# EAGLE design mux (EAGLE 9.6.2)
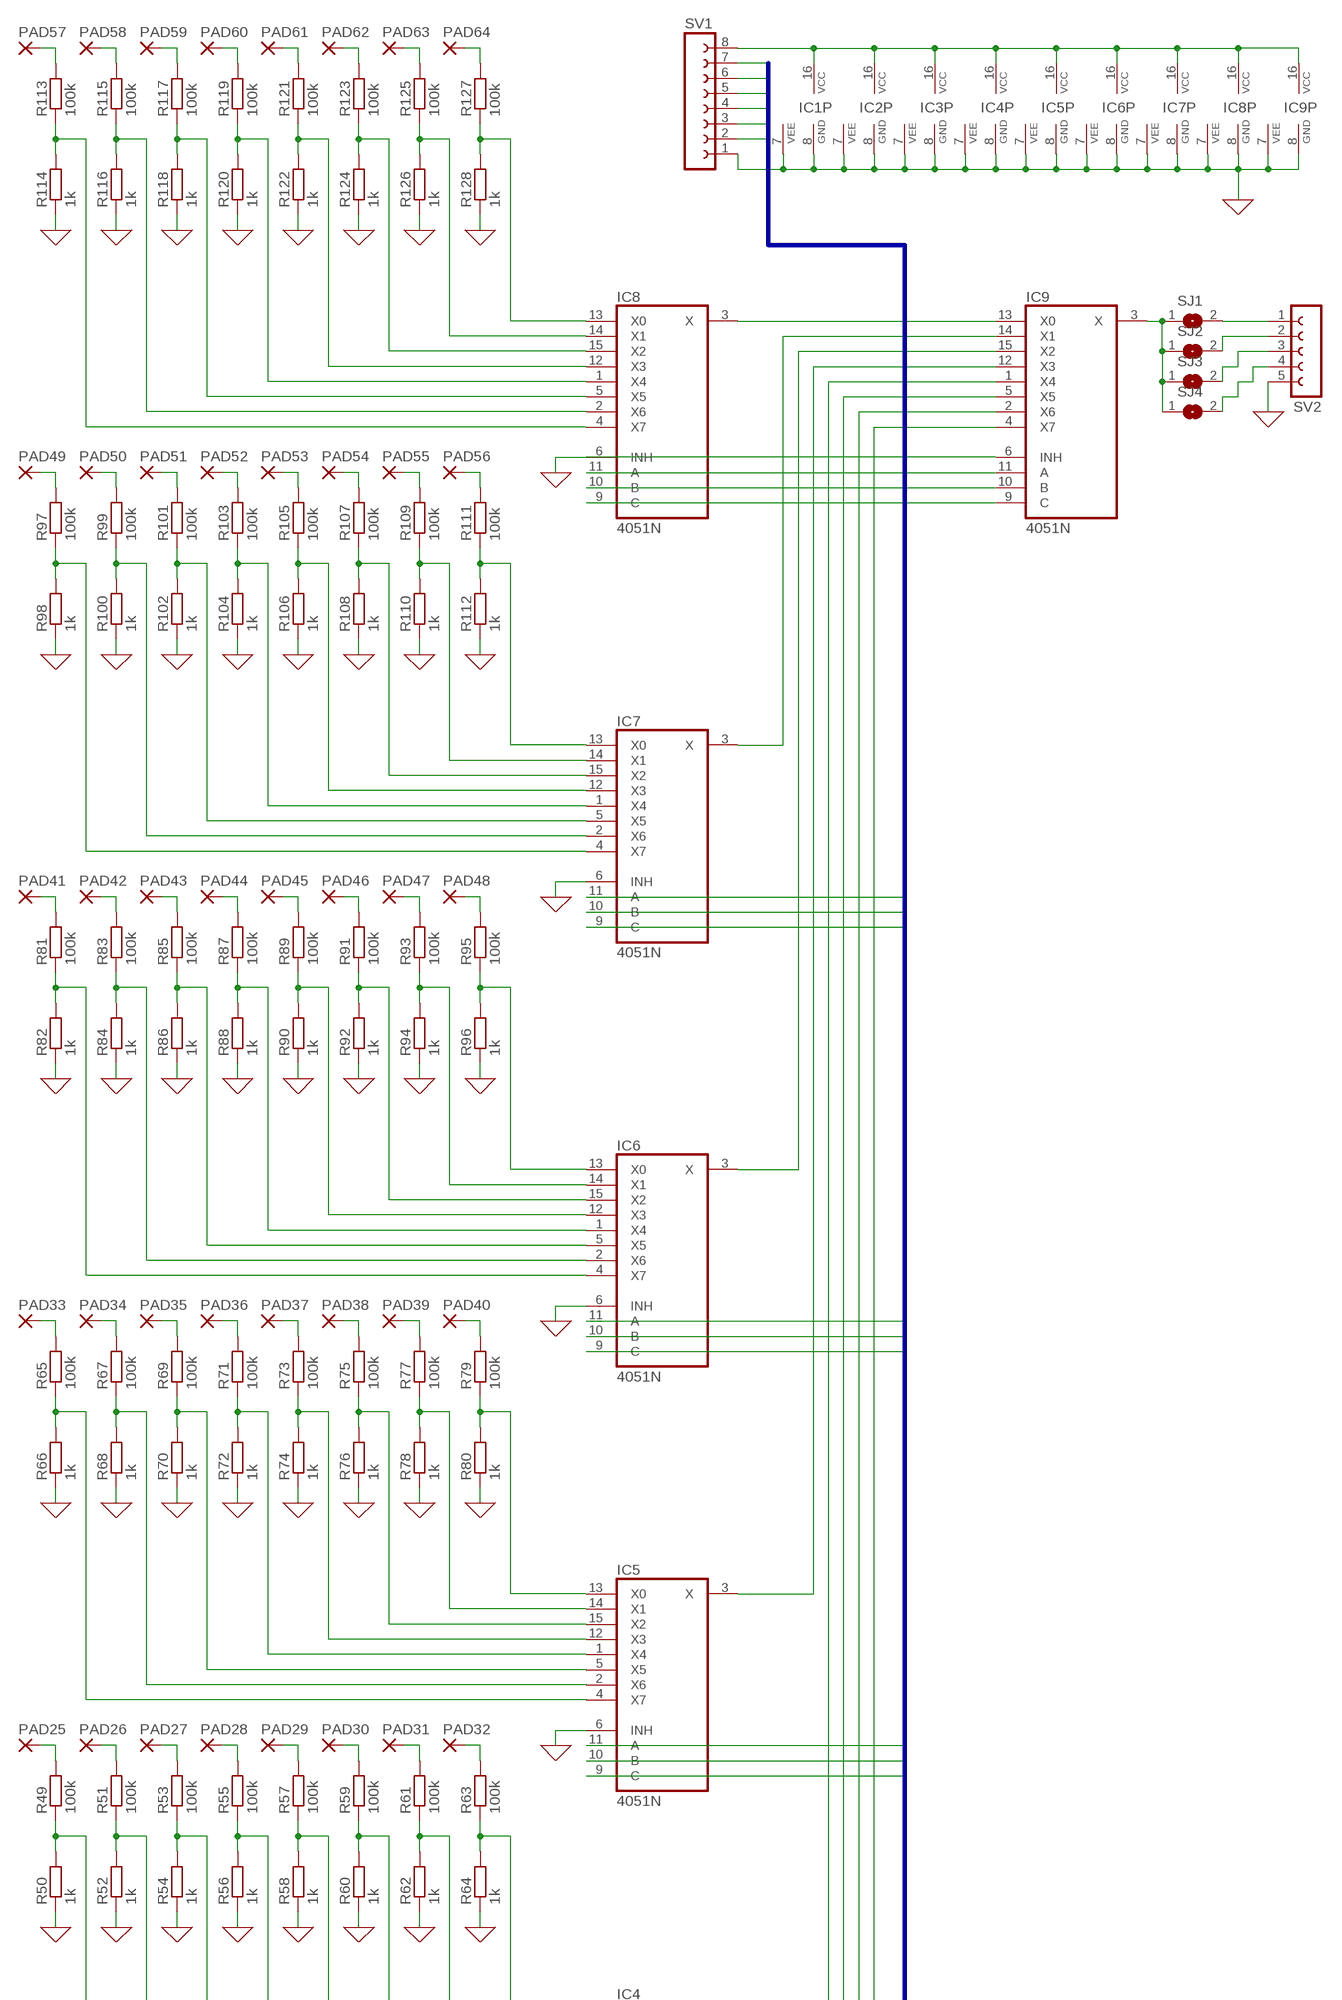
[diagram p0: schematic, sheet 1, part 1 of 2]
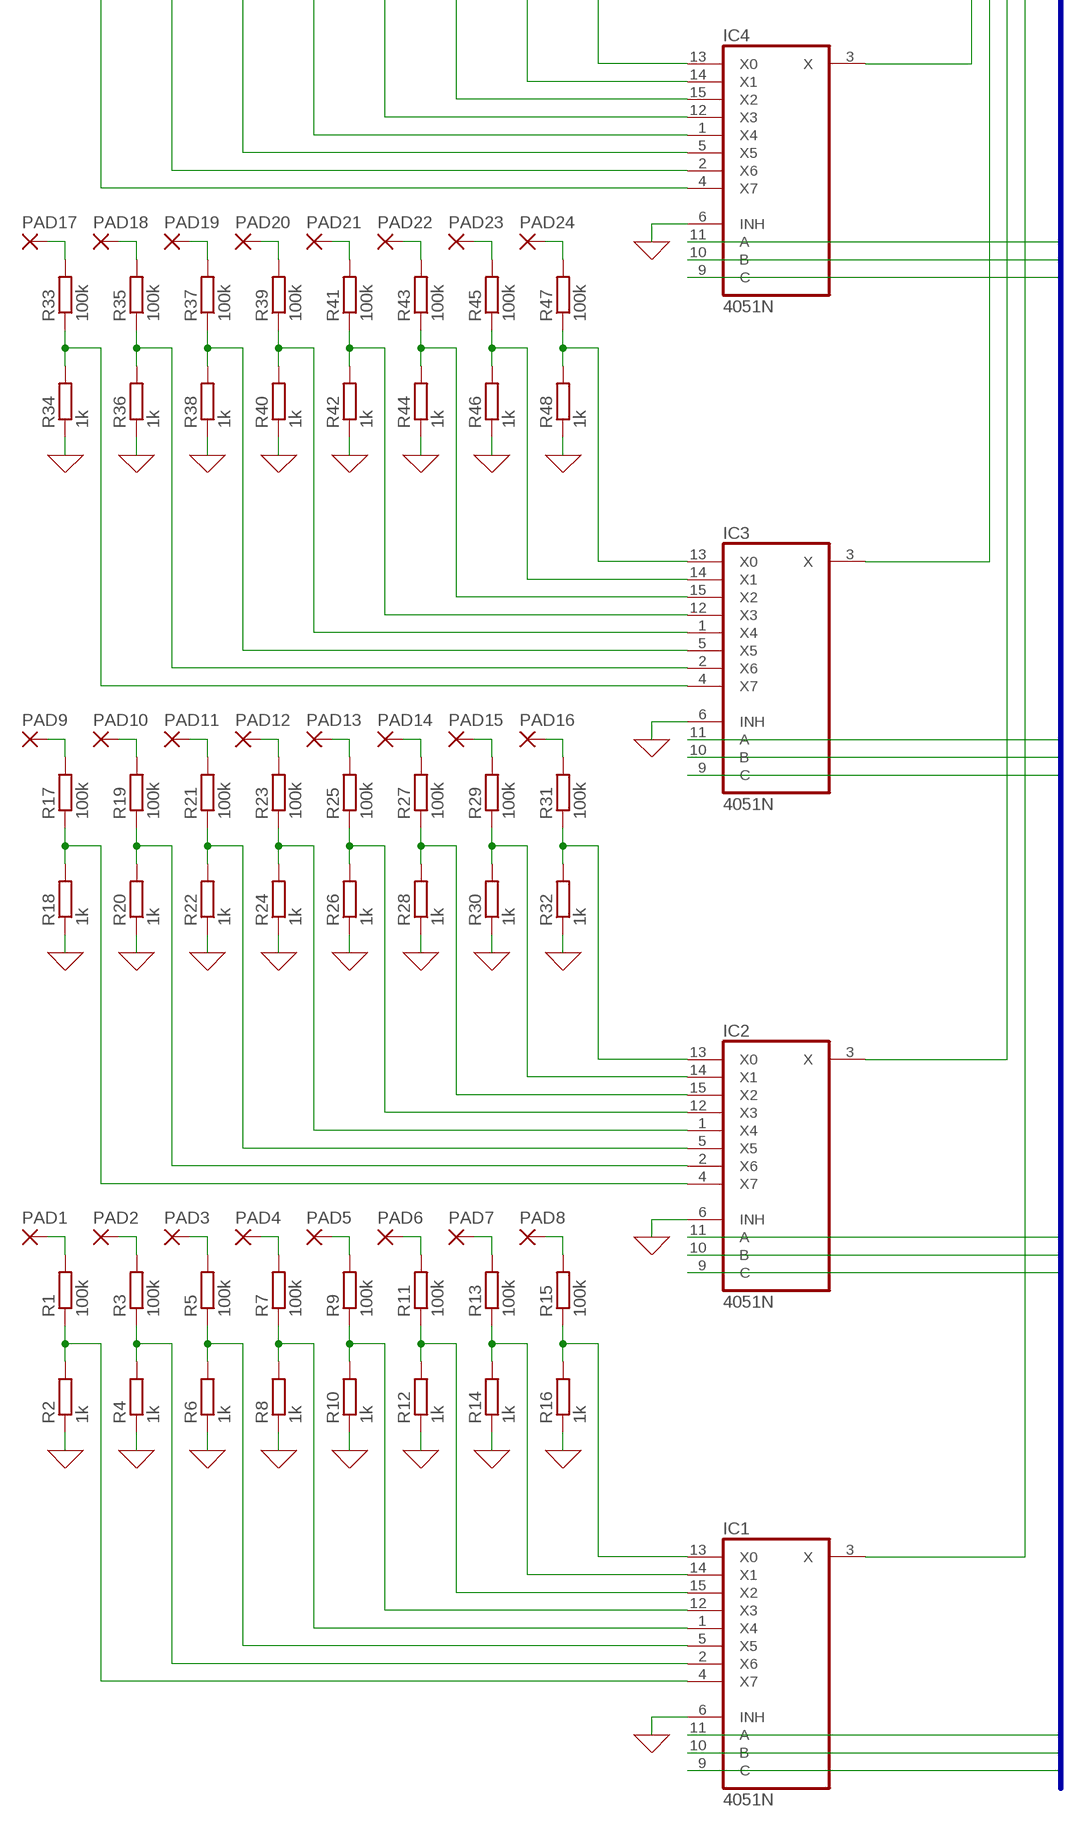
[diagram p1: schematic, sheet 1, part 2 of 2]

## Parts
IC1  4051N  [DIL16]
IC2  4051N  [DIL16]
IC3  4051N  [DIL16]
IC4  4051N  [DIL16]
IC5  4051N  [DIL16]
IC6  4051N  [DIL16]
IC7  4051N  [DIL16]
IC8  4051N  [DIL16]
IC9  4051N  [DIL16]
PAD1  1,6/0,9  [1,6/0,9]
PAD2  1,6/0,9  [1,6/0,9]
PAD3  1,6/0,9  [1,6/0,9]
PAD4  1,6/0,9  [1,6/0,9]
PAD5  1,6/0,9  [1,6/0,9]
PAD6  1,6/0,9  [1,6/0,9]
PAD7  1,6/0,9  [1,6/0,9]
PAD8  1,6/0,9  [1,6/0,9]
PAD9  1,6/0,9  [1,6/0,9]
PAD10  1,6/0,9  [1,6/0,9]
PAD11  1,6/0,9  [1,6/0,9]
PAD12  1,6/0,9  [1,6/0,9]
PAD13  1,6/0,9  [1,6/0,9]
PAD14  1,6/0,9  [1,6/0,9]
PAD15  1,6/0,9  [1,6/0,9]
PAD16  1,6/0,9  [1,6/0,9]
PAD17  1,6/0,9  [1,6/0,9]
PAD18  1,6/0,9  [1,6/0,9]
PAD19  1,6/0,9  [1,6/0,9]
PAD20  1,6/0,9  [1,6/0,9]
PAD21  1,6/0,9  [1,6/0,9]
PAD22  1,6/0,9  [1,6/0,9]
PAD23  1,6/0,9  [1,6/0,9]
PAD24  1,6/0,9  [1,6/0,9]
PAD25  1,6/0,9  [1,6/0,9]
PAD26  1,6/0,9  [1,6/0,9]
PAD27  1,6/0,9  [1,6/0,9]
PAD28  1,6/0,9  [1,6/0,9]
PAD29  1,6/0,9  [1,6/0,9]
PAD30  1,6/0,9  [1,6/0,9]
PAD31  1,6/0,9  [1,6/0,9]
PAD32  1,6/0,9  [1,6/0,9]
PAD33  1,6/0,9  [1,6/0,9]
PAD34  1,6/0,9  [1,6/0,9]
PAD35  1,6/0,9  [1,6/0,9]
PAD36  1,6/0,9  [1,6/0,9]
PAD37  1,6/0,9  [1,6/0,9]
PAD38  1,6/0,9  [1,6/0,9]
PAD39  1,6/0,9  [1,6/0,9]
PAD40  1,6/0,9  [1,6/0,9]
PAD41  1,6/0,9  [1,6/0,9]
PAD42  1,6/0,9  [1,6/0,9]
PAD43  1,6/0,9  [1,6/0,9]
PAD44  1,6/0,9  [1,6/0,9]
PAD45  1,6/0,9  [1,6/0,9]
PAD46  1,6/0,9  [1,6/0,9]
PAD47  1,6/0,9  [1,6/0,9]
PAD48  1,6/0,9  [1,6/0,9]
PAD49  1,6/0,9  [1,6/0,9]
PAD50  1,6/0,9  [1,6/0,9]
PAD51  1,6/0,9  [1,6/0,9]
PAD52  1,6/0,9  [1,6/0,9]
PAD53  1,6/0,9  [1,6/0,9]
PAD54  1,6/0,9  [1,6/0,9]
PAD55  1,6/0,9  [1,6/0,9]
PAD56  1,6/0,9  [1,6/0,9]
PAD57  1,6/0,9  [1,6/0,9]
PAD58  1,6/0,9  [1,6/0,9]
PAD59  1,6/0,9  [1,6/0,9]
PAD60  1,6/0,9  [1,6/0,9]
PAD61  1,6/0,9  [1,6/0,9]
PAD62  1,6/0,9  [1,6/0,9]
PAD63  1,6/0,9  [1,6/0,9]
PAD64  1,6/0,9  [1,6/0,9]
R1  100k  R-EU_R1206  [R1206]
R2  1k  R-EU_R1206  [R1206]
R3  100k  R-EU_R1206  [R1206]
R4  1k  R-EU_R1206  [R1206]
R5  100k  R-EU_R1206  [R1206]
R6  1k  R-EU_R1206  [R1206]
R7  100k  R-EU_R1206  [R1206]
R8  1k  R-EU_R1206  [R1206]
R9  100k  R-EU_R1206  [R1206]
R10  1k  R-EU_R1206  [R1206]
R11  100k  R-EU_R1206  [R1206]
R12  1k  R-EU_R1206  [R1206]
R13  100k  R-EU_R1206  [R1206]
R14  1k  R-EU_R1206  [R1206]
R15  100k  R-EU_R1206  [R1206]
R16  1k  R-EU_R1206  [R1206]
R17  100k  R-EU_R1206  [R1206]
R18  1k  R-EU_R1206  [R1206]
R19  100k  R-EU_R1206  [R1206]
R20  1k  R-EU_R1206  [R1206]
R21  100k  R-EU_R1206  [R1206]
R22  1k  R-EU_R1206  [R1206]
R23  100k  R-EU_R1206  [R1206]
R24  1k  R-EU_R1206  [R1206]
R25  100k  R-EU_R1206  [R1206]
R26  1k  R-EU_R1206  [R1206]
R27  100k  R-EU_R1206  [R1206]
R28  1k  R-EU_R1206  [R1206]
R29  100k  R-EU_R1206  [R1206]
R30  1k  R-EU_R1206  [R1206]
R31  100k  R-EU_R1206  [R1206]
R32  1k  R-EU_R1206  [R1206]
R33  100k  R-EU_R1206  [R1206]
R34  1k  R-EU_R1206  [R1206]
R35  100k  R-EU_R1206  [R1206]
R36  1k  R-EU_R1206  [R1206]
R37  100k  R-EU_R1206  [R1206]
R38  1k  R-EU_R1206  [R1206]
R39  100k  R-EU_R1206  [R1206]
R40  1k  R-EU_R1206  [R1206]
R41  100k  R-EU_R1206  [R1206]
R42  1k  R-EU_R1206  [R1206]
R43  100k  R-EU_R1206  [R1206]
R44  1k  R-EU_R1206  [R1206]
R45  100k  R-EU_R1206  [R1206]
R46  1k  R-EU_R1206  [R1206]
R47  100k  R-EU_R1206  [R1206]
R48  1k  R-EU_R1206  [R1206]
R49  100k  R-EU_R1206  [R1206]
R50  1k  R-EU_R1206  [R1206]
R51  100k  R-EU_R1206  [R1206]
R52  1k  R-EU_R1206  [R1206]
R53  100k  R-EU_R1206  [R1206]
R54  1k  R-EU_R1206  [R1206]
R55  100k  R-EU_R1206  [R1206]
R56  1k  R-EU_R1206  [R1206]
R57  100k  R-EU_R1206  [R1206]
R58  1k  R-EU_R1206  [R1206]
R59  100k  R-EU_R1206  [R1206]
R60  1k  R-EU_R1206  [R1206]
R61  100k  R-EU_R1206  [R1206]
R62  1k  R-EU_R1206  [R1206]
R63  100k  R-EU_R1206  [R1206]
R64  1k  R-EU_R1206  [R1206]
R65  100k  R-EU_R1206  [R1206]
R66  1k  R-EU_R1206  [R1206]
R67  100k  R-EU_R1206  [R1206]
R68  1k  R-EU_R1206  [R1206]
R69  100k  R-EU_R1206  [R1206]
R70  1k  R-EU_R1206  [R1206]
R71  100k  R-EU_R1206  [R1206]
R72  1k  R-EU_R1206  [R1206]
R73  100k  R-EU_R1206  [R1206]
R74  1k  R-EU_R1206  [R1206]
R75  100k  R-EU_R1206  [R1206]
R76  1k  R-EU_R1206  [R1206]
R77  100k  R-EU_R1206  [R1206]
R78  1k  R-EU_R1206  [R1206]
R79  100k  R-EU_R1206  [R1206]
R80  1k  R-EU_R1206  [R1206]
R81  100k  R-EU_R1206  [R1206]
R82  1k  R-EU_R1206  [R1206]
R83  100k  R-EU_R1206  [R1206]
R84  1k  R-EU_R1206  [R1206]
R85  100k  R-EU_R1206  [R1206]
R86  1k  R-EU_R1206  [R1206]
R87  100k  R-EU_R1206  [R1206]
R88  1k  R-EU_R1206  [R1206]
R89  100k  R-EU_R1206  [R1206]
R90  1k  R-EU_R1206  [R1206]
R91  100k  R-EU_R1206  [R1206]
R92  1k  R-EU_R1206  [R1206]
R93  100k  R-EU_R1206  [R1206]
R94  1k  R-EU_R1206  [R1206]
R95  100k  R-EU_R1206  [R1206]
R96  1k  R-EU_R1206  [R1206]
R97  100k  R-EU_R1206  [R1206]
R98  1k  R-EU_R1206  [R1206]
R99  100k  R-EU_R1206  [R1206]
R100  1k  R-EU_R1206  [R1206]
R101  100k  R-EU_R1206  [R1206]
R102  1k  R-EU_R1206  [R1206]
R103  100k  R-EU_R1206  [R1206]
R104  1k  R-EU_R1206  [R1206]
R105  100k  R-EU_R1206  [R1206]
R106  1k  R-EU_R1206  [R1206]
R107  100k  R-EU_R1206  [R1206]
R108  1k  R-EU_R1206  [R1206]
R109  100k  R-EU_R1206  [R1206]
R110  1k  R-EU_R1206  [R1206]
R111  100k  R-EU_R1206  [R1206]
R112  1k  R-EU_R1206  [R1206]
R113  100k  R-EU_R1206  [R1206]
R114  1k  R-EU_R1206  [R1206]
R115  100k  R-EU_R1206  [R1206]
R116  1k  R-EU_R1206  [R1206]
R117  100k  R-EU_R1206  [R1206]
R118  1k  R-EU_R1206  [R1206]
R119  100k  R-EU_R1206  [R1206]
R120  1k  R-EU_R1206  [R1206]
R121  100k  R-EU_R1206  [R1206]
R122  1k  R-EU_R1206  [R1206]
R123  100k  R-EU_R1206  [R1206]
R124  1k  R-EU_R1206  [R1206]
R125  100k  R-EU_R1206  [R1206]
R126  1k  R-EU_R1206  [R1206]
R127  100k  R-EU_R1206  [R1206]
R128  1k  R-EU_R1206  [R1206]
SJ1  SJ  [SJ]
SJ2  SJ  [SJ]
SJ3  SJ  [SJ]
SJ4  SJ  [SJ]
SV1  FE08-1  [FE08]
SV2  FE05-1  [FE05-1]

## Nets
0: IC1.6(INH) IC1.7(VEE) IC1.8(GND) IC2.6(INH) IC2.7(VEE) IC2.8(GND) IC3.6(INH) IC3.7(VEE) IC3.8(GND) IC4.6(INH) IC4.7(VEE) IC4.8(GND) IC5.6(INH) IC5.7(VEE) IC5.8(GND) IC6.6(INH) IC6.7(VEE) IC6.8(GND) IC7.6(INH) IC7.7(VEE) IC7.8(GND) IC8.6(INH) IC8.7(VEE) IC8.8(GND) IC9.6(INH) IC9.7(VEE) IC9.8(GND) R2.1 R4.1 R6.1 R8.1 R10.1 R12.1 R14.1 R16.1 R18.1 R20.1 R22.1 R24.1 R26.1 R28.1 R30.1 R32.1 R34.1 R36.1 R38.1 R40.1 R42.1 R44.1 R46.1 R48.1 R50.1 R52.1 R54.1 R56.1 R58.1 R60.1 R62.1 R64.1 R66.1 R68.1 R70.1 R72.1 R74.1 R76.1 R78.1 R80.1 R82.1 R84.1 R86.1 R88.1 R90.1 R92.1 R94.1 R96.1 R98.1 R100.1 R102.1 R104.1 R106.1 R108.1 R110.1 R112.1 R114.1 R116.1 R118.1 R120.1 R122.1 R124.1 R126.1 R128.1 SV1.1 SV2.5 ; supply symbol labelled GND
N$1: IC1.4(X7) R1.1 R2.2
N$2: PAD1.1(P) R1.2
N$3: IC1.2(X6) R3.1 R4.2
N$4: PAD2.1(P) R3.2
N$5: IC1.5(X5) R5.1 R6.2
N$6: PAD3.1(P) R5.2
N$7: IC1.1(X4) R7.1 R8.2
N$8: PAD4.1(P) R7.2
N$9: IC1.12(X3) R9.1 R10.2
N$10: PAD5.1(P) R9.2
N$11: IC1.15(X2) R11.1 R12.2
N$12: PAD6.1(P) R11.2
N$13: IC1.14(X1) R13.1 R14.2
N$14: PAD7.1(P) R13.2
N$15: IC1.13(X0) R15.1 R16.2
N$16: PAD8.1(P) R15.2
N$17: IC8.3(X) IC9.13(X0)
N$18: IC2.4(X7) R17.1 R18.2
N$19: PAD9.1(P) R17.2
N$20: IC2.2(X6) R19.1 R20.2
N$21: PAD10.1(P) R19.2
N$22: IC2.5(X5) R21.1 R22.2
N$23: PAD11.1(P) R21.2
N$24: IC2.1(X4) R23.1 R24.2
N$25: PAD12.1(P) R23.2
N$26: IC2.12(X3) R25.1 R26.2
N$27: PAD13.1(P) R25.2
N$28: IC2.15(X2) R27.1 R28.2
N$29: PAD14.1(P) R27.2
N$30: IC2.14(X1) R29.1 R30.2
N$31: PAD15.1(P) R29.2
N$32: IC2.13(X0) R31.1 R32.2
N$33: PAD16.1(P) R31.2
N$34: IC3.4(X7) R33.1 R34.2
N$35: PAD17.1(P) R33.2
N$36: IC3.2(X6) R35.1 R36.2
N$37: PAD18.1(P) R35.2
N$38: IC3.5(X5) R37.1 R38.2
N$39: PAD19.1(P) R37.2
N$40: IC3.1(X4) R39.1 R40.2
N$41: PAD20.1(P) R39.2
N$42: IC3.12(X3) R41.1 R42.2
N$43: PAD21.1(P) R41.2
N$44: IC3.15(X2) R43.1 R44.2
N$45: PAD22.1(P) R43.2
N$46: IC3.14(X1) R45.1 R46.2
N$47: PAD23.1(P) R45.2
N$48: IC3.13(X0) R47.1 R48.2
N$49: PAD24.1(P) R47.2
N$50: IC4.4(X7) R49.1 R50.2
N$51: PAD25.1(P) R49.2
N$52: IC4.2(X6) R51.1 R52.2
N$53: PAD26.1(P) R51.2
N$54: IC4.5(X5) R53.1 R54.2
N$55: PAD27.1(P) R53.2
N$56: IC4.1(X4) R55.1 R56.2
N$57: PAD28.1(P) R55.2
N$58: IC4.12(X3) R57.1 R58.2
N$59: PAD29.1(P) R57.2
N$60: IC4.15(X2) R59.1 R60.2
N$61: PAD30.1(P) R59.2
N$62: IC4.14(X1) R61.1 R62.2
N$63: PAD31.1(P) R61.2
N$64: IC4.13(X0) R63.1 R64.2
N$65: PAD32.1(P) R63.2
N$66: IC5.4(X7) R65.1 R66.2
N$67: PAD33.1(P) R65.2
N$68: IC5.2(X6) R67.1 R68.2
N$69: PAD34.1(P) R67.2
N$70: IC5.5(X5) R69.1 R70.2
N$71: PAD35.1(P) R69.2
N$72: IC5.1(X4) R71.1 R72.2
N$73: PAD36.1(P) R71.2
N$74: IC5.12(X3) R73.1 R74.2
N$75: PAD37.1(P) R73.2
N$76: IC5.15(X2) R75.1 R76.2
N$77: PAD38.1(P) R75.2
N$78: IC5.14(X1) R77.1 R78.2
N$79: PAD39.1(P) R77.2
N$80: IC5.13(X0) R79.1 R80.2
N$81: PAD40.1(P) R79.2
N$82: IC6.4(X7) R81.1 R82.2
N$83: PAD41.1(P) R81.2
N$84: IC6.2(X6) R83.1 R84.2
N$85: PAD42.1(P) R83.2
N$86: IC6.5(X5) R85.1 R86.2
N$87: PAD43.1(P) R85.2
N$88: IC6.1(X4) R87.1 R88.2
N$89: PAD44.1(P) R87.2
N$90: IC6.12(X3) R89.1 R90.2
N$91: PAD45.1(P) R89.2
N$92: IC6.15(X2) R91.1 R92.2
N$93: PAD46.1(P) R91.2
N$94: IC6.14(X1) R93.1 R94.2
N$95: PAD47.1(P) R93.2
N$96: IC6.13(X0) R95.1 R96.2
N$97: PAD48.1(P) R95.2
N$98: IC7.4(X7) R97.1 R98.2
N$99: PAD49.1(P) R97.2
N$100: IC7.2(X6) R99.1 R100.2
N$101: PAD50.1(P) R99.2
N$102: IC7.5(X5) R101.1 R102.2
N$103: PAD51.1(P) R101.2
N$104: IC7.1(X4) R103.1 R104.2
N$105: PAD52.1(P) R103.2
N$106: IC7.12(X3) R105.1 R106.2
N$107: PAD53.1(P) R105.2
N$108: IC7.15(X2) R107.1 R108.2
N$109: PAD54.1(P) R107.2
N$110: IC7.14(X1) R109.1 R110.2
N$111: PAD55.1(P) R109.2
N$112: IC7.13(X0) R111.1 R112.2
N$113: PAD56.1(P) R111.2
N$114: IC8.4(X7) R113.1 R114.2
N$115: PAD57.1(P) R113.2
N$116: IC8.2(X6) R115.1 R116.2
N$117: PAD58.1(P) R115.2
N$118: IC8.5(X5) R117.1 R118.2
N$119: PAD59.1(P) R117.2
N$120: IC8.1(X4) R119.1 R120.2
N$121: PAD60.1(P) R119.2
N$122: IC8.12(X3) R121.1 R122.2
N$123: PAD61.1(P) R121.2
N$124: IC8.15(X2) R123.1 R124.2
N$125: PAD62.1(P) R123.2
N$126: IC8.14(X1) R125.1 R126.2
N$127: PAD63.1(P) R125.2
N$128: IC8.13(X0) R127.1 R128.2
N$129: PAD64.1(P) R127.2
N$130: IC7.3(X) IC9.14(X1)
N$131: IC6.3(X) IC9.15(X2)
N$132: IC5.3(X) IC9.12(X3)
N$133: IC4.3(X) IC9.1(X4)
N$134: IC3.3(X) IC9.5(X5)
N$135: IC2.3(X) IC9.2(X6)
N$136: IC1.3(X) IC9.4(X7)
N$137: IC9.3(X) SJ1.1 SJ2.1 SJ3.1 SJ4.1
N$138: SJ1.2 SV2.1
N$139: SJ2.2 SV2.2
N$140: SJ3.2 SV2.3
N$141: SJ4.2 SV2.4
REG1: IC1.11(A) IC2.11(A) IC3.11(A) IC4.11(A) IC5.11(A) IC6.11(A) IC7.11(A) IC8.11(A) SV1.7
REG2: IC1.10(B) IC2.10(B) IC3.10(B) IC4.10(B) IC5.10(B) IC6.10(B) IC7.10(B) IC8.10(B) SV1.6
REG3: IC1.9(C) IC2.9(C) IC3.9(C) IC4.9(C) IC5.9(C) IC6.9(C) IC7.9(C) IC8.9(C) SV1.5
REG4: IC9.11(A) SV1.4
REG5: IC9.10(B) SV1.3
REG6: IC9.9(C) SV1.2
VCC: IC1.16(VCC) IC2.16(VCC) IC3.16(VCC) IC4.16(VCC) IC5.16(VCC) IC6.16(VCC) IC7.16(VCC) IC8.16(VCC) IC9.16(VCC) SV1.8

## Buses
INSEL:REG[1..6]

## Library data of the parts
IC1-IC9 = 40xx:4051: 8-channel ANALOG MULTIPLEXER
PAD1-PAD64 = wirepad:1,6/0,9: THROUGH-HOLE PAD
R1-R128 = rcl:R-EU_: RESISTOR, European symbol; SPICEPREFIX: R
SJ1-SJ4 = jumper:SJ: SMD solder JUMPER
SV1 = con-lsta:FE08-1: FEMALE HEADER; OC_FARNELL: unknown; OC_NEWARK: unknown
SV2 = con-lsta:FE05-1: FEMALE HEADER; OC_FARNELL: unknown; OC_NEWARK: unknown

## Board
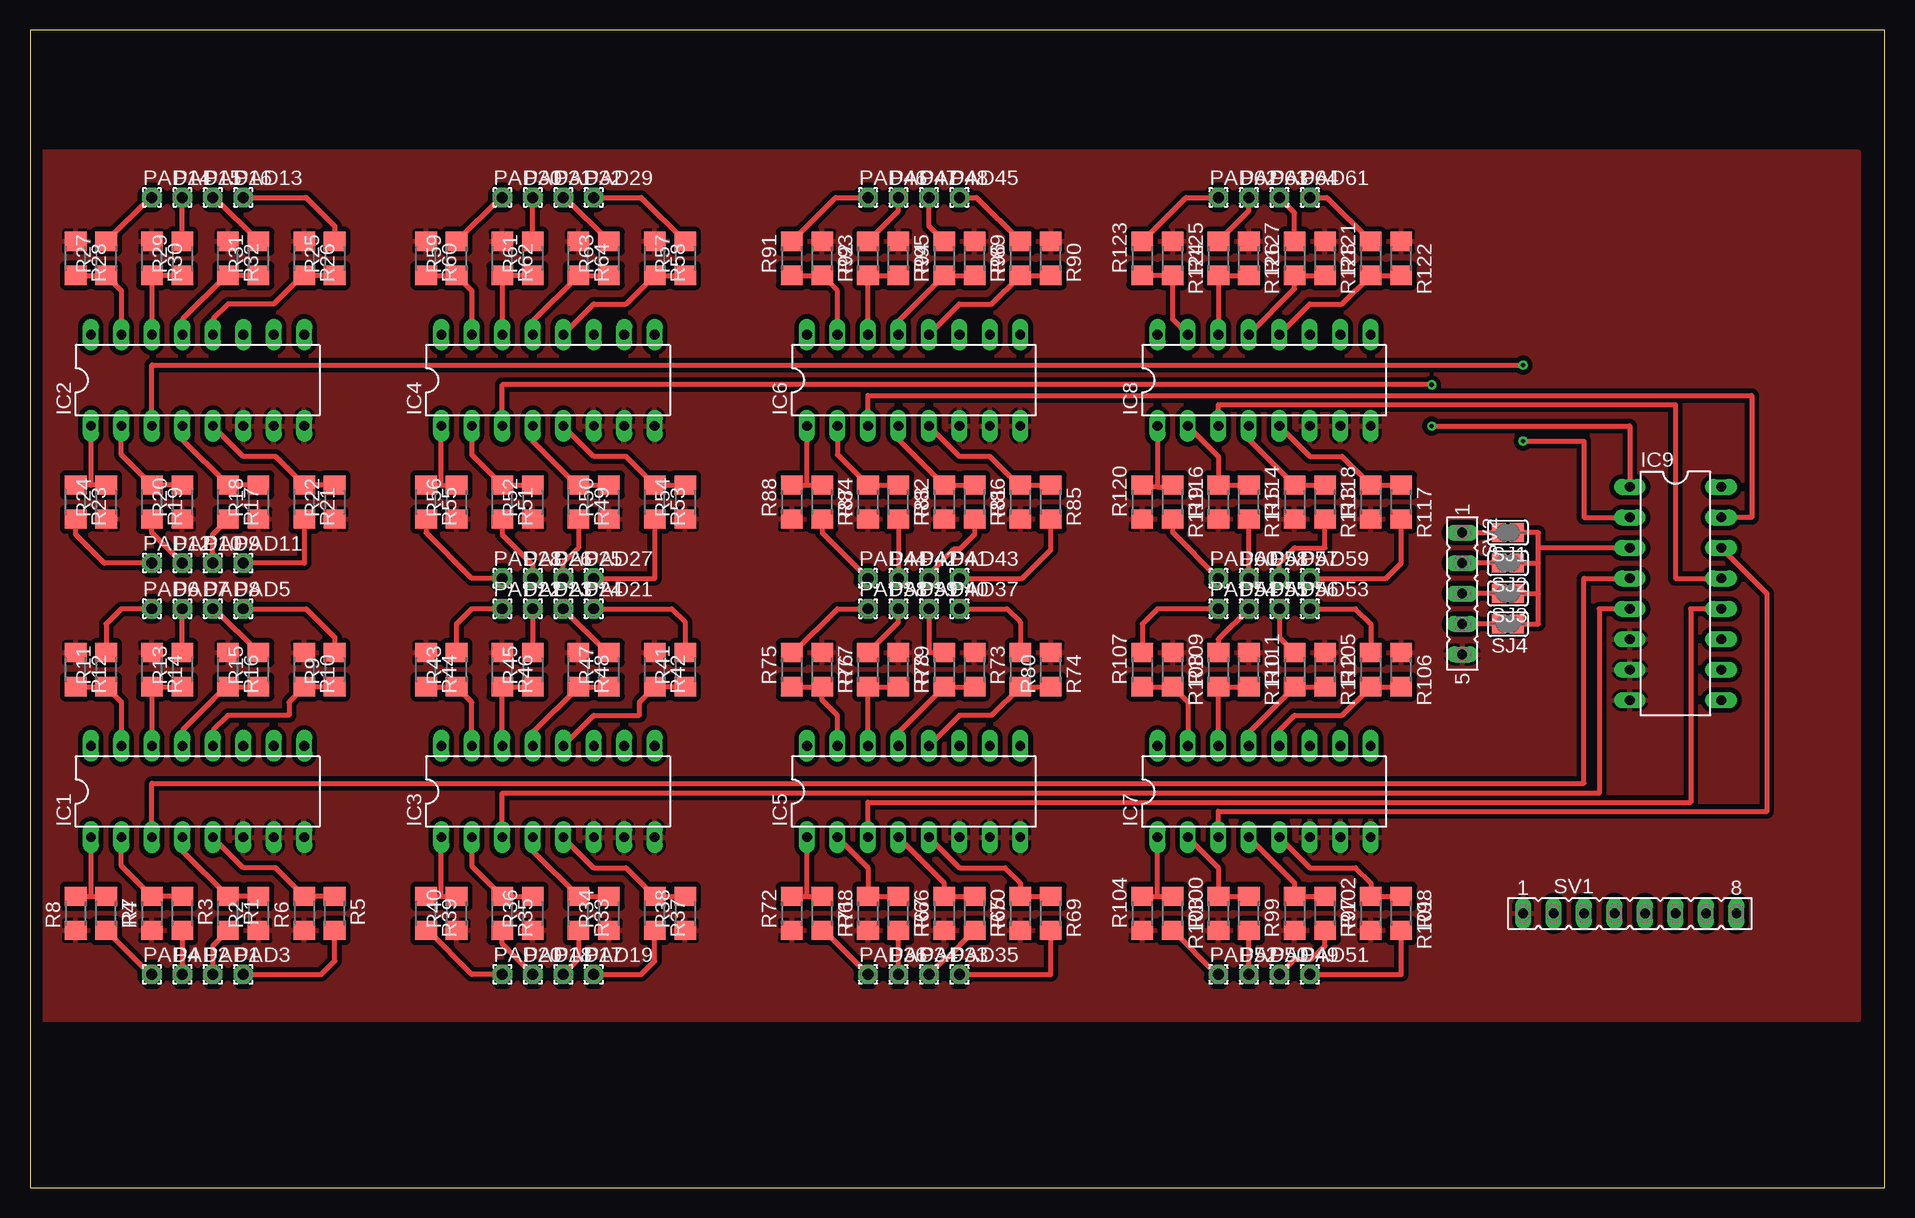
[diagram p2: board, top side]
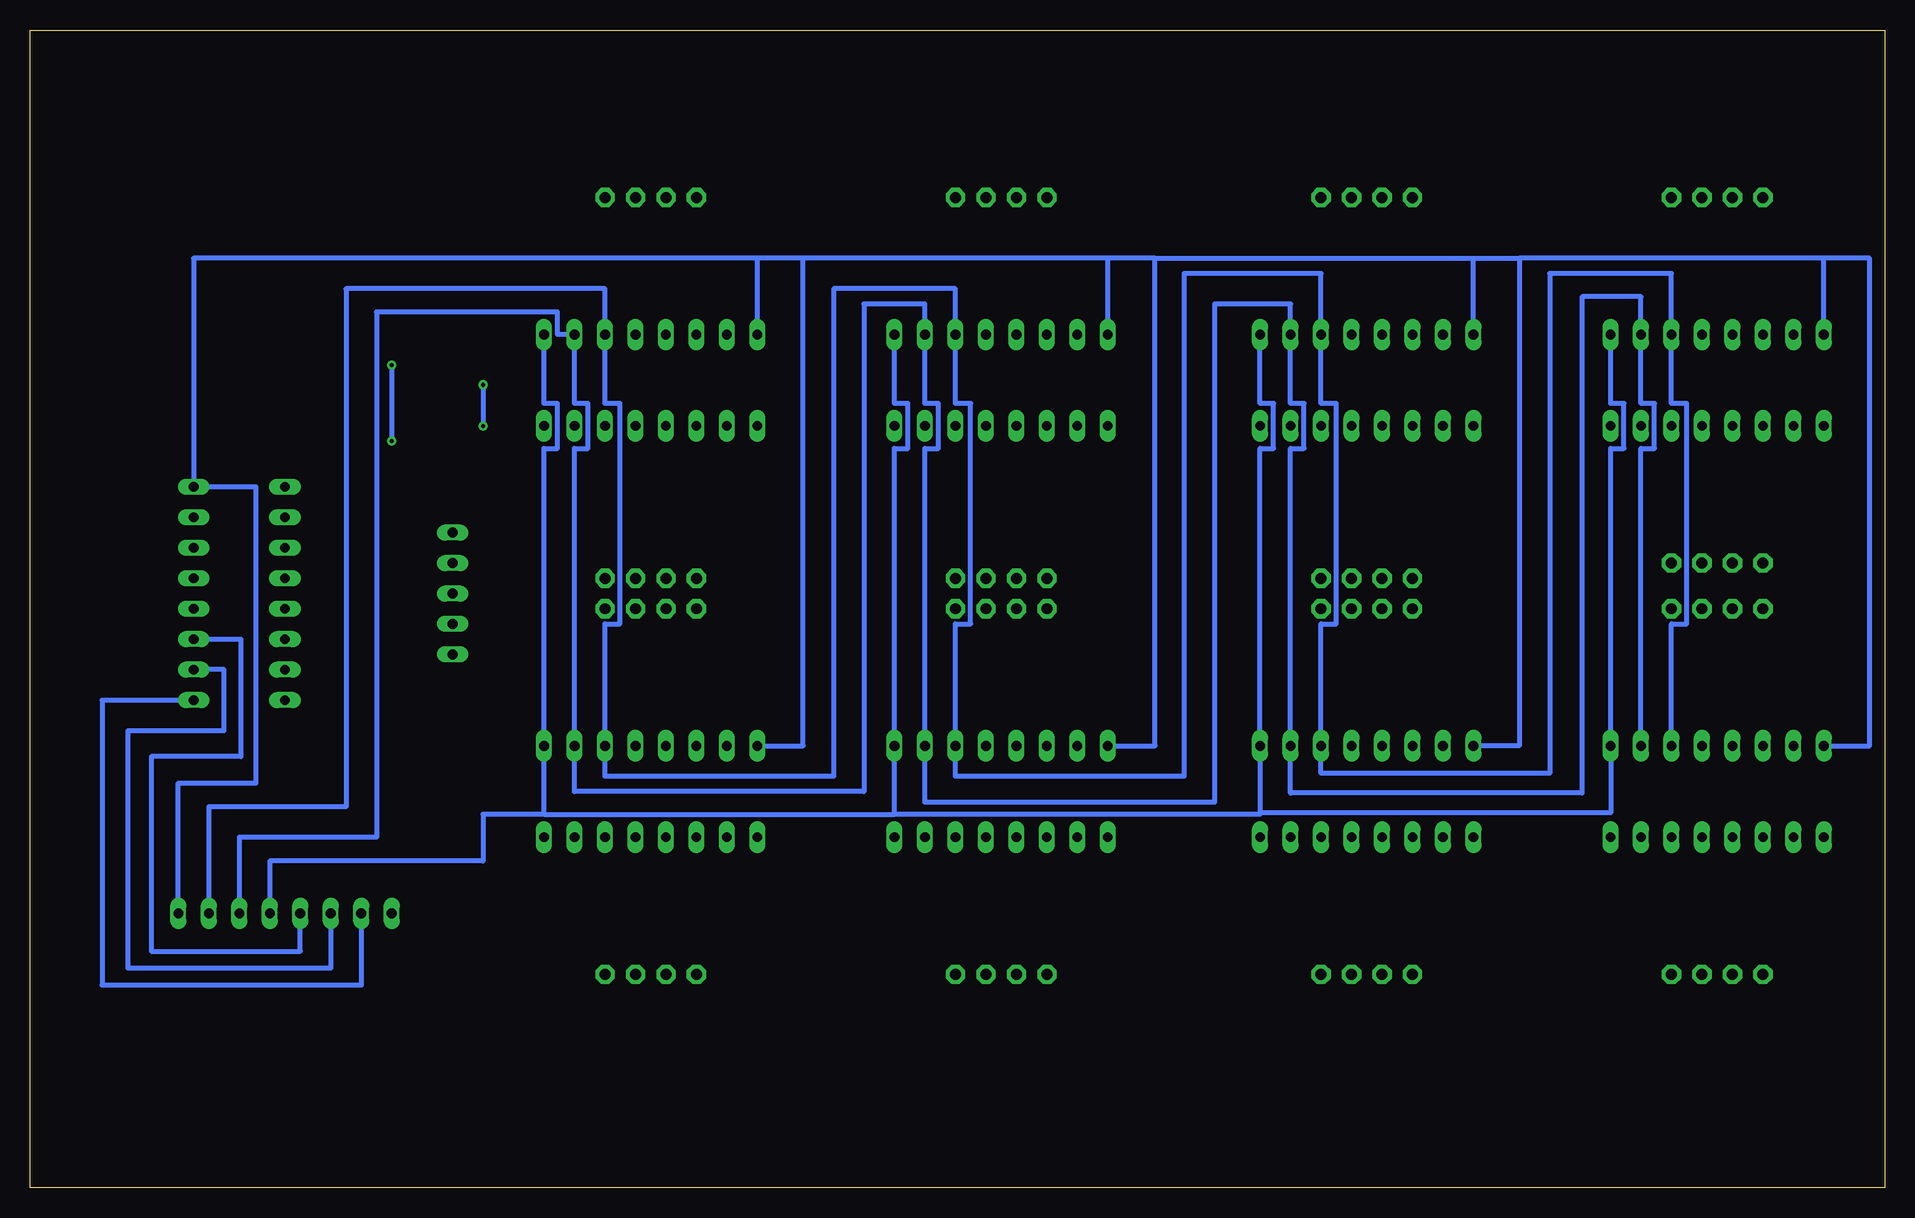
[diagram p3: board, bottom side, seen from below]

Size 154.61 x 96.51 mm. Coordinates in mm from the lower left corner, seen from the top.
Outline: 0,0 154.61,0 154.61,96.51 0,96.51 0,0
Copper layers (1*16): Top 0.035mm / dielectric 1.5mm / Bottom 0.035mm
Design rules "default": minimum track width 6mil, minimum drill 0.35mm, track to track 6mil, track to pad 6mil, pad to pad 6mil, via to via 6mil, smd to smd 6mil, copper to edge 40mil, drill to drill 6mil, minimum pad ring 10mil, minimum via ring 8mil, stop-mask expansion 4mil, vias tented up to drill 0mil, thermal gap 10mil

### Footprints (pad centres in the part's own frame; a part is rotated, then mirrored left to right if it is on the bottom)
DIL16 = drill 0.813 long: 1 -8.89,-3.81; 2 -6.35,-3.81; 3 -3.81,-3.81; 4 -1.27,-3.81; 5 1.27,-3.81; 6 3.81,-3.81; 7 6.35,-3.81; 8 8.89,-3.81; 9 8.89,3.81; 10 6.35,3.81; 11 3.81,3.81; 12 1.27,3.81; 13 -1.27,3.81; 14 -3.81,3.81; 15 -6.35,3.81; 16 -8.89,3.81
1,6/0,9 = drill 0.914 pad 1.6 octagon: 1 0,0
R1206 = smd 1.6 x 1.803: 1 -1.422,0; 2 1.422,0
SJ = smd 1.168 x 1.6: 1 -0.762,0; 2 0.762,0
FE08 = drill 0.813 long: 1 -8.89,0; 2 -6.35,0; 3 -3.81,0; 4 -1.27,0; 5 1.27,0; 6 3.81,0; 7 6.35,0; 8 8.89,0
FE05-1 = drill 0.813 long: 1 -5.08,0; 2 -2.54,0; 3 0,0; 4 2.54,0; 5 5.08,0

### Placement (x,y rotation side)
IC1  13.97,33.02 0 top
IC2  13.97,67.31 0 top
IC3  43.18,33.02 0 top
IC4  43.18,67.31 0 top
IC5  73.66,33.02 0 top
IC6  73.66,67.31 0 top
IC7  102.87,33.02 0 top
IC8  102.87,67.31 0 top
IC9  137.16,49.53 270 top
PAD1  15.24,17.78 0 top
PAD2  12.7,17.78 0 top
PAD3  17.78,17.78 0 top
PAD4  10.16,17.78 0 top
PAD5  17.78,48.26 0 top
PAD6  10.16,48.26 0 top
PAD7  12.7,48.26 0 top
PAD8  15.24,48.26 0 top
PAD9  15.24,52.07 0 top
PAD10  12.7,52.07 0 top
PAD11  17.78,52.07 0 top
PAD12  10.16,52.07 0 top
PAD13  17.78,82.55 0 top
PAD14  10.16,82.55 0 top
PAD15  12.7,82.55 0 top
PAD16  15.24,82.55 0 top
PAD17  44.45,17.78 0 top
PAD18  41.91,17.78 0 top
PAD19  46.99,17.78 0 top
PAD20  39.37,17.78 0 top
PAD21  46.99,48.26 0 top
PAD22  39.37,48.26 0 top
PAD23  41.91,48.26 0 top
PAD24  44.45,48.26 0 top
PAD25  44.45,50.8 0 top
PAD26  41.91,50.8 0 top
PAD27  46.99,50.8 0 top
PAD28  39.37,50.8 0 top
PAD29  46.99,82.55 0 top
PAD30  39.37,82.55 0 top
PAD31  41.91,82.55 0 top
PAD32  44.45,82.55 0 top
PAD33  74.93,17.78 0 top
PAD34  72.39,17.78 0 top
PAD35  77.47,17.78 0 top
PAD36  69.85,17.78 0 top
PAD37  77.47,48.26 0 top
PAD38  69.85,48.26 0 top
PAD39  72.39,48.26 0 top
PAD40  74.93,48.26 0 top
PAD41  74.93,50.8 0 top
PAD42  72.39,50.8 0 top
PAD43  77.47,50.8 0 top
PAD44  69.85,50.8 0 top
PAD45  77.47,82.55 0 top
PAD46  69.85,82.55 0 top
PAD47  72.39,82.55 0 top
PAD48  74.93,82.55 0 top
PAD49  104.14,17.78 0 top
PAD50  101.6,17.78 0 top
PAD51  106.68,17.78 0 top
PAD52  99.06,17.78 0 top
PAD53  106.68,48.26 0 top
PAD54  99.06,48.26 0 top
PAD55  101.6,48.26 0 top
PAD56  104.14,48.26 0 top
PAD57  104.14,50.8 0 top
PAD58  101.6,50.8 0 top
PAD59  106.68,50.8 0 top
PAD60  99.06,50.8 0 top
PAD61  106.68,82.55 0 top
PAD62  99.06,82.55 0 top
PAD63  101.6,82.55 0 top
PAD64  104.14,82.55 0 top
R1  16.51,22.86 270 top
R2  19.05,22.86 90 top
R3  12.7,22.86 270 top
R4  10.16,22.86 90 top
R5  25.4,22.86 270 top
R6  22.86,22.86 90 top
R7  6.35,22.86 270 top
R8  3.81,22.86 90 top
R9  25.4,43.18 90 top
R10  22.86,43.18 270 top
R11  6.35,43.18 90 top
R12  3.81,43.18 270 top
R13  12.7,43.18 90 top
R14  10.16,43.18 270 top
R15  19.05,43.18 90 top
R16  16.51,43.18 270 top
R17  16.51,57.15 270 top
R18  19.05,57.15 90 top
R19  10.16,57.15 270 top
R20  12.7,57.15 90 top
R21  22.86,57.15 270 top
R22  25.4,57.15 90 top
R23  3.81,57.15 270 top
R24  6.35,57.15 90 top
R25  25.4,77.47 90 top
R26  22.86,77.47 270 top
R27  6.35,77.47 90 top
R28  3.81,77.47 270 top
R29  12.7,77.47 90 top
R30  10.16,77.47 270 top
R31  19.05,77.47 90 top
R32  16.51,77.47 270 top
R33  45.72,22.86 270 top
R34  48.26,22.86 90 top
R35  39.37,22.86 270 top
R36  41.91,22.86 90 top
R37  52.07,22.86 270 top
R38  54.61,22.86 90 top
R39  33.02,22.86 270 top
R40  35.56,22.86 90 top
R41  54.61,43.18 90 top
R42  52.07,43.18 270 top
R43  35.56,43.18 90 top
R44  33.02,43.18 270 top
R45  41.91,43.18 90 top
R46  39.37,43.18 270 top
R47  48.26,43.18 90 top
R48  45.72,43.18 270 top
R49  45.72,57.15 270 top
R50  48.26,57.15 90 top
R51  39.37,57.15 270 top
R52  41.91,57.15 90 top
R53  52.07,57.15 270 top
R54  54.61,57.15 90 top
R55  33.02,57.15 270 top
R56  35.56,57.15 90 top
R57  54.61,77.47 90 top
R58  52.07,77.47 270 top
R59  35.56,77.47 90 top
R60  33.02,77.47 270 top
R61  41.91,77.47 90 top
R62  39.37,77.47 270 top
R63  48.26,77.47 90 top
R64  45.72,77.47 270 top
R65  78.74,22.86 270 top
R66  76.2,22.86 90 top
R67  72.39,22.86 270 top
R68  69.85,22.86 90 top
R69  85.09,22.86 270 top
R70  82.55,22.86 90 top
R71  66.04,22.86 270 top
R72  63.5,22.86 90 top
R73  82.55,43.18 90 top
R74  85.09,43.18 270 top
R75  63.5,43.18 90 top
R76  66.04,43.18 270 top
R77  69.85,43.18 90 top
R78  72.39,43.18 270 top
R79  76.2,43.18 90 top
R80  78.74,43.18 270 top
R81  78.74,57.15 270 top
R82  76.2,57.15 90 top
R83  72.39,57.15 270 top
R84  69.85,57.15 90 top
R85  85.09,57.15 270 top
R86  82.55,57.15 90 top
R87  66.04,57.15 270 top
R88  63.5,57.15 90 top
R89  82.55,77.47 90 top
R90  85.09,77.47 270 top
R91  63.5,77.47 90 top
R92  66.04,77.47 270 top
R93  69.85,77.47 90 top
R94  72.39,77.47 270 top
R95  76.2,77.47 90 top
R96  78.74,77.47 270 top
R97  107.95,22.86 270 top
R98  105.41,22.86 90 top
R99  101.6,22.86 270 top
R100  99.06,22.86 90 top
R101  114.3,22.86 270 top
R102  111.76,22.86 90 top
R103  95.25,22.86 270 top
R104  92.71,22.86 90 top
R105  111.76,43.18 90 top
R106  114.3,43.18 270 top
R107  92.71,43.18 90 top
R108  95.25,43.18 270 top
R109  99.06,43.18 90 top
R110  101.6,43.18 270 top
R111  105.41,43.18 90 top
R112  107.95,43.18 270 top
R113  107.95,57.15 270 top
R114  105.41,57.15 90 top
R115  101.6,57.15 270 top
R116  99.06,57.15 90 top
R117  114.3,57.15 270 top
R118  111.76,57.15 90 top
R119  95.25,57.15 270 top
R120  92.71,57.15 90 top
R121  111.76,77.47 90 top
R122  114.3,77.47 270 top
R123  92.71,77.47 90 top
R124  95.25,77.47 270 top
R125  99.06,77.47 90 top
R126  101.6,77.47 270 top
R127  105.41,77.47 90 top
R128  107.95,77.47 270 top
SJ1  123.19,54.61 180 top
SJ2  123.19,52.07 180 top
SJ3  123.19,49.53 180 top
SJ4  123.19,46.99 180 top
SV1  133.35,22.86 0 top
SV2  119.38,49.53 270 top

### Tracks (layer width: path | path; a pad name or v marks a point on that pad's centre or on a via)
0
  pour Top (isolate 0.406): 0,13.97 0,86.36 152.4,86.36 152.4,13.97
N$1
  Top 0.406: R2.2 R1.1 12.7,28.09 IC1.4
N$2
  Top 0.406: R1.2 15.24,20.17 PAD1.1
N$3
  Top 0.406: R3.1 R4.2 7.62,26.82 IC1.2
N$4
  Top 0.406: R3.2 PAD2.1
N$5
  Top 0.406: R5.1 R6.2 20.47,26.67 17.78,26.67 IC1.5
N$6
  Top 0.406: PAD3.1 24.28,17.78 25.4,18.9 R5.2
N$7
  Top 0.406: R8.2 5.08,24.28 | 5.08,24.28 R7.1 | IC1.1 5.08,24.28
N$8
  Top 0.406: R7.2 10.01,17.78 PAD4.1
N$9
  Top 0.406: R9.1 R10.2 21.59,40.49 21.59,39.37 16.51,39.37 15.24,38.1 IC1.12
N$10
  Top 0.406: PAD5.1 23.01,48.26 25.4,45.87 R9.2
N$11
  Top 0.406: R12.2 R11.1 7.62,40.49 IC1.15
N$12
  Top 0.406: PAD6.1 7.62,48.26 6.35,46.99 R11.2
N$13
  Top 0.406: R13.1 R14.2 IC1.14
N$14
  Top 0.406: R13.2 PAD7.1
N$15
  Top 0.406: IC1.13 12.7,38.1 15.24,40.64 16.36,41.76 R16.2 R15.1
N$16
  Top 0.406: PAD8.1 15.39,48.26 R15.2
N$17
  Top 0.406: IC8.3 99.06,65.28 137.16,65.28 137.16,50.8 IC9.13
N$18
  Top 0.406: R18.2 R17.1 12.7,62.38 IC2.4
N$19
  Top 0.406: PAD9.1 15.24,54.46 R17.2
N$20
  Top 0.406: R20.2 R19.1 7.62,61.11 IC2.2
N$21
  Top 0.406: PAD10.1 10.16,54.61 R19.2
N$22
  Top 0.406: R22.2 R21.1 20.47,60.96 17.78,60.96 IC2.5
N$23
  Top 0.406: R21.2 22.86,52.07 PAD11.1
N$24
  Top 0.406: R24.2 5.08,58.57 | 5.08,58.57 R23.1 | IC2.1 5.08,58.57
N$25
  Top 0.406: PAD12.1 6.2,52.07 3.81,54.46 R23.2
N$26
  Top 0.406: R25.1 R26.2 22.71,76.05 20.32,73.66 16.51,73.66 15.24,72.39 IC2.12
N$27
  Top 0.406: PAD13.1 23.01,82.55 25.4,80.16 R25.2
N$28
  Top 0.406: R28.2 R27.1 7.62,74.78 IC2.15
N$29
  Top 0.406: R27.2 10.01,82.55 PAD14.1
N$30
  Top 0.406: R29.1 R30.2 IC2.14
N$31
  Top 0.406: R29.2 PAD15.1
N$32
  Top 0.406: IC2.13 12.7,72.39 16.36,76.05 R32.2 R31.1
N$33
  Top 0.406: PAD16.1 15.39,82.55 R31.2
N$34
  Top 0.406: IC3.4 41.91,28.09 R33.1 R34.2
N$35
  Top 0.406: R33.2 45.72,19.05 PAD17.1
N$36
  Top 0.406: IC3.2 36.83,26.82 R35.1 R36.2
N$37
  Top 0.406: PAD18.1 39.37,20.32 R35.2
N$38
  Top 0.406: IC3.5 46.99,26.67 49.68,26.67 R37.1 R38.2
N$39
  Top 0.406: PAD19.1 50.95,17.78 52.07,18.9 R37.2
N$40
  Top 0.406: R39.1 34.29,24.28 | 34.29,24.28 R40.2 | 34.29,24.28 IC3.1
N$41
  Top 0.406: PAD20.1 36.83,17.78 33.17,21.44 R39.2
N$42
  Top 0.406: IC3.12 46.99,39.37 50.8,39.37 50.8,40.49 R42.2 R41.1
N$43
  Top 0.406: PAD21.1 53.49,48.26 54.61,47.14 R41.2
N$44
  Top 0.406: IC3.15 36.83,40.49 R43.1 R44.2
N$45
  Top 0.406: PAD22.1 36.83,48.26 35.56,46.99 R43.2
N$46
  Top 0.406: IC3.14 R46.2 R45.1
N$47
  Top 0.406: PAD23.1 R45.2
N$48
  Top 0.406: IC3.13 41.91,37.95 R48.2 R47.1
N$49
  Top 0.406: R47.2 48.11,44.6 PAD24.1
N$50
  Top 0.406: IC4.4 41.91,62.23 45.57,58.57 R49.1 R50.2
N$51
  Top 0.406: PAD25.1 44.45,52.07 45.72,53.34 R49.2
N$52
  Top 0.406: IC4.2 36.83,61.11 R51.1 R52.2
N$53
  Top 0.406: R51.2 39.37,54.46 41.91,51.92 PAD26.1
N$54
  Top 0.406: IC4.5 46.99,60.96 49.68,60.96 R53.1 R54.2
N$55
  Top 0.406: PAD27.1 52.07,50.8 R53.2
N$56
  Top 0.406: R55.1 34.29,58.57 | 34.29,58.57 R56.2 | 34.29,58.57 IC4.1
N$57
  Top 0.406: PAD28.1 36.83,50.8 33.02,54.61 R55.2
N$58
  Top 0.406: IC4.12 46.99,73.66 49.68,73.66 R58.2 R57.1
N$59
  Top 0.406: PAD29.1 50.95,82.55 R57.2
N$60
  Top 0.406: R60.2 R59.1 36.83,74.78 IC4.15
N$61
  Top 0.406: R59.2 39.22,82.55 PAD30.1
N$62
  Top 0.406: R61.1 R62.2 IC4.14
N$63
  Top 0.406: R61.2 PAD31.1
N$64
  Top 0.406: IC4.13 41.91,72.24 R64.2 R63.1
N$65
  Top 0.406: PAD32.1 44.6,82.55 R63.2
N$66
  Top 0.406: IC5.4 76.2,25.4 R66.2 R65.1
N$67
  Top 0.406: PAD33.1 76.2,19.05 76.35,19.05 R65.2
N$68
  Top 0.406: IC5.2 69.85,26.67 R68.2 R67.1
N$69
  Top 0.406: PAD34.1 R67.2
N$70
  Top 0.406: IC5.5 77.47,26.67 81.28,26.67 82.55,25.4 R70.2 R69.1
N$71
  Top 0.406: PAD35.1 85.09,17.78 R69.2
N$72
  Top 0.406: R72.2 64.77,24.28 | 64.77,24.28 R71.1 | 64.77,24.28 IC5.1
N$73
  Top 0.406: PAD36.1 66.19,21.44 R71.2
N$74
  Top 0.406: R74.2 R73.1 80.16,39.37 77.47,39.37 IC5.12
N$75
  Top 0.406: PAD37.1 81.43,48.26 82.55,47.14 R73.2
N$76
  Top 0.406: IC5.15 67.31,39.37 66.04,40.64 R76.2 R75.1
N$77
  Top 0.406: R75.2 63.65,44.6 67.31,48.26 PAD38.1
N$78
  Top 0.406: IC5.14 R77.1 R78.2
N$79
  Top 0.406: R77.2 72.39,47.14 PAD39.1
N$80
  Top 0.406: IC5.13 72.39,37.95 R79.1 R80.2
N$81
  Top 0.406: PAD40.1 74.93,44.6 R79.2
N$82
  Top 0.406: IC6.4 72.39,62.38 R82.2 R81.1
N$83
  Top 0.406: R81.2 78.74,54.46 77.51,53.23 76.99,53.23 74.93,51.16 PAD41.1
N$84
  Top 0.406: IC6.2 67.31,61.11 R84.2 R83.1
N$85
  Top 0.406: R83.2 PAD42.1
N$86
  Top 0.406: R85.1 R86.2 82.4,58.57 80.01,60.96 77.47,60.96 IC6.5
N$87
  Top 0.406: PAD43.1 82.7,50.8 85.09,53.19 R85.2
N$88
  Top 0.406: R88.2 64.77,58.57 | 64.77,58.57 R87.1 | 64.77,58.57 IC6.1
N$89
  Top 0.406: PAD44.1 66.04,54.61 R87.2
N$90
  Top 0.406: IC6.12 77.47,73.66 80.16,73.66 R89.1 R90.2
N$91
  Top 0.406: PAD45.1 78.89,82.55 R89.2
N$92
  Top 0.406: IC6.15 67.31,74.78 R92.2 R91.1
N$93
  Top 0.406: R91.2 67.16,82.55 PAD46.1
N$94
  Top 0.406: IC6.14 R93.1 R94.2
N$95
  Top 0.406: R93.2 72.39,81.43 PAD47.1
N$96
  Top 0.406: IC6.13 72.39,72.24 R95.1 R96.2
N$97
  Top 0.406: R95.2 74.93,80.16 PAD48.1
N$98
  Top 0.406: IC7.4 105.41,25.4 R98.2 R97.1
N$99
  Top 0.406: PAD49.1 105.41,19.05 106.83,19.05 107.95,20.17 R97.2
N$100
  Top 0.406: IC7.2 99.06,26.67 R100.2 R99.1
N$101
  Top 0.406: PAD50.1 R99.2
N$102
  Top 0.406: IC7.5 106.68,26.67 110.49,26.67 111.76,25.4 R102.2 R101.1
N$103
  Top 0.406: PAD51.1 114.3,17.78 R101.2
N$104
  Top 0.406: R104.2 93.98,24.28 | 93.98,24.28 R103.1 | 93.98,24.28 IC7.1
N$105
  Top 0.406: PAD52.1 98.91,17.78 R103.2
N$106
  Top 0.406: IC7.12 104.14,38.1 105.41,39.37 109.37,39.37 R105.1 R106.2
N$107
  Top 0.406: PAD53.1 110.49,48.26 111.76,46.99 R105.2
N$108
  Top 0.406: R107.1 R108.2 96.52,40.49 IC7.15
N$109
  Top 0.406: PAD54.1 93.98,48.26 92.71,46.99 R107.2
N$110
  Top 0.406: IC7.14 R109.1 R110.2
N$111
  Top 0.406: PAD55.1 99.06,45.72 R109.2
N$112
  Top 0.406: IC7.13 101.6,37.95 R111.1 R112.2
N$113
  Top 0.406: PAD56.1 104.14,45.87 R111.2
N$114
  Top 0.406: IC8.4 101.6,62.38 R114.2 R113.1
N$115
  Top 0.406: PAD57.1 104.14,52.07 105.41,53.34 107.95,53.34 R113.2
N$116
  Top 0.406: IC8.2 99.06,60.96 R116.2 R115.1
N$117
  Top 0.406: PAD58.1 R115.2
N$118
  Top 0.406: IC8.5 106.68,60.96 109.37,60.96 R118.2 R117.1
N$119
  Top 0.406: PAD59.1 113.03,50.8 114.3,52.07 R117.2
N$120
  Top 0.406: IC8.1 93.98,58.42 | 93.98,58.42 92.86,58.42 R120.2 | 93.98,58.42 95.1,58.42 R119.1
N$121
  Top 0.406: PAD60.1 95.25,54.61 R119.2
N$122
  Top 0.406: IC8.12 106.68,73.66 109.37,73.66 R121.1 R122.2
N$123
  Top 0.406: PAD61.1 108.1,82.55 R121.2
N$124
  Top 0.406: IC8.15 95.25,72.39 R124.2 R123.1
N$125
  Top 0.406: R123.2 96.37,82.55 PAD62.1
N$126
  Top 0.406: IC8.14 R125.1 R126.2
N$127
  Top 0.406: R125.2 101.6,81.43 PAD63.1
N$128
  Top 0.406: IC8.13 105.41,74.93 R127.1 R128.2
N$129
  Top 0.406: R127.2 105.41,81.28 PAD64.1
N$130
  Top 0.406: IC7.3 99.06,31.37 144.78,31.37 144.78,49.53 IC9.14
N$131
  Top 0.406: IC6.3 69.85,66.04 143.51,66.04 143.51,55.88 IC9.15
N$132
  Top 0.406: IC5.3 69.85,32.13 138.43,32.13 138.43,48.26 IC9.12
N$133  (via drill 0.35)
  Top 0.406: IC4.3 39.37,66.93 v116.84,66.93 | v116.84,63.5 133.35,63.5 IC9.1
  Bottom 0.406: v116.84,66.93 v116.84,63.5
N$134
  Top 0.406: IC3.3 39.37,32.89 130.81,32.89 130.81,48.26 IC9.5
N$135  (via drill 0.35)
  Top 0.406: IC2.3 10.16,68.58 v124.46,68.58 | v124.46,62.23 129.54,62.23 129.54,55.88 IC9.2
  Bottom 0.406: v124.46,68.58 v124.46,62.23
N$136
  Top 0.406: IC9.4 129.54,50.8 129.54,33.71 10.16,33.71 IC1.3
N$137
  Top 0.406: 125.73,49.53 125.73,46.99 SJ4.1 | 125.73,49.53 125.73,52.07 | 125.73,52.07 125.73,53.34 | 125.73,53.34 125.73,54.61 SJ1.1 | IC9.3 125.73,53.34 | SJ2.1 125.73,52.07 | SJ3.1 125.73,49.53
N$138
  Top 0.406: SV2.1 SJ1.2
N$139
  Top 0.406: SJ2.2 SV2.2
N$140
  Top 0.406: SJ3.2 SV2.3
N$141
  Top 0.406: SJ4.2 SV2.4
REG1
  Bottom 0.406: IC3.11 46.99,47 45.73,47 45.73,65.38 46.99,65.38 IC4.11 46.99,76.2 58.42,76.2 58.42,34.29 77.47,34.29 IC5.11 77.47,47 76.21,47 76.21,65.38 77.47,65.38 IC6.11 77.47,74.93 87.63,74.93 87.63,34.29 106.68,34.29 IC7.11 106.68,47 105.42,47 105.42,65.38 106.68,65.38 IC8.11 106.68,74.93 128.27,74.93 128.27,31.75 139.7,31.75 SV1.7 | 17.8,36.83 IC1.11 17.78,47 16.52,47 16.52,65.38 17.78,65.38 IC2.11 17.78,76.2 27.94,76.2 27.94,34.54 46.99,34.54 IC3.11 | 46.97,36.83 IC3.11
REG2
  Bottom 0.406: IC1.10 20.32,61.62 19.2,61.62 19.2,65.38 20.32,65.38 IC2.10 20.32,74.27 25.25,74.27 25.25,32.89 49.53,32.89 IC3.10 49.53,61.62 48.41,61.62 48.41,65.38 49.53,65.38 IC4.10 49.53,73.66 55.88,73.66 55.88,32.13 80.01,32.13 IC5.10 80.01,61.62 78.89,61.62 78.89,65.38 80.01,65.38 IC6.10 80.01,73.66 85.09,73.66 85.09,33.02 109.22,33.02 IC7.10 109.22,61.62 108.1,61.62 108.1,65.38 109.22,65.38 IC8.10 110.64,71.12 110.64,73 125.73,73 125.73,29.21 137.16,29.21 SV1.6
REG3
  Bottom 0.406: IC4.9 52.07,65.38 50.95,65.38 50.95,61.62 52.07,61.62 IC3.9 52.07,31.24 | IC2.9 22.86,65.38 21.74,65.38 21.74,61.62 22.86,61.62 IC1.9 22.86,31.24 52.07,31.24 | IC6.9 82.55,65.38 81.43,65.38 81.43,61.62 82.55,61.62 IC5.9 82.55,31.12 | IC8.9 111.76,65.38 110.64,65.38 110.64,61.62 111.76,61.62 IC7.9 111.76,31.12 | 52.07,31.24 52.07,31.12 82.55,31.12 | 111.76,31.12 116.84,31.12 116.84,27.23 134.62,27.23 SV1.5 | 111.76,31.12 82.55,31.12
REG4
  Bottom 0.406: SV1.4 132.08,19.71 144.5,19.71 144.5,35.94 137.03,35.94 137.03,45.72 IC9.11
REG5
  Bottom 0.406: SV1.3 129.54,18.29 146.43,18.29 146.43,38.1 138.43,38.1 138.43,43.18 IC9.10
REG6
  Bottom 0.406: SV1.2 127,16.89 148.59,16.89 148.59,40.64 IC9.9
VCC
  Bottom 0.406: 5.08,77.47 30.48,77.47 | 60.83,77.47 34.29,77.47 | 34.29,77.47 30.48,77.47 | 60.83,77.47 64.77,77.47 | 64.77,77.47 90.17,77.47 | 90.17,77.47 93.98,77.47 | 93.98,77.47 140.97,77.47 IC9.16 135.76,58.42 135.76,33.73 142.24,33.73 SV1.8 | 90.17,77.47 90.17,36.83 IC7.16 | 60.83,77.47 60.83,36.83 IC5.16 | 5.08,77.47 1.27,77.47 1.27,36.83 IC1.16 | IC2.16 5.08,77.47 | IC4.16 34.29,77.47 | IC6.16 64.77,77.47 | IC8.16 93.98,77.47 | IC3.16 30.48,36.83 30.48,77.47